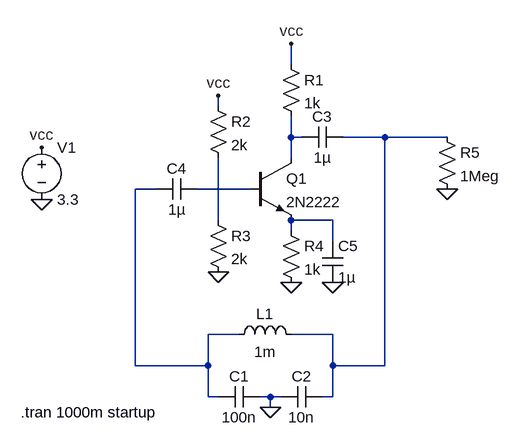
[diagram p0: schematic Colpitts_Oscillator.asc]
Colpitts_Oscillator.asc, the LTspice schematic file:
Version 4
SHEET 1 880 680
WIRE 416 -224 416 -256
WIRE 304 -160 304 -176
WIRE 416 -112 416 -144
WIRE 432 -112 416 -112
WIRE 560 -112 496 -112
WIRE 656 -112 560 -112
WIRE 416 -80 416 -112
WIRE 208 -32 176 -32
WIRE 352 -32 272 -32
WIRE 304 16 304 -80
WIRE 480 16 416 16
WIRE 416 32 416 16
WIRE 480 48 480 16
WIRE 336 192 288 192
WIRE 480 192 416 192
WIRE 176 240 176 -32
WIRE 288 240 288 192
WIRE 288 240 176 240
WIRE 480 240 480 192
WIRE 560 240 560 -112
WIRE 560 240 480 240
WIRE 288 288 288 240
WIRE 304 288 288 288
WIRE 384 288 368 288
WIRE 400 288 384 288
WIRE 480 288 480 240
WIRE 480 288 464 288
WIRE 384 304 384 288
FLAG 32 -96 vcc
FLAG 32 -16 0
FLAG 304 96 0
FLAG 416 112 0
FLAG 480 112 0
FLAG 384 304 0
FLAG 304 -176 vcc
FLAG 416 -256 vcc
FLAG 656 -32 0
SYMBOL voltage 32 -112 R0
WINDOW 123 0 0 Left 0
WINDOW 39 0 0 Left 0
SYMATTR InstName V1
SYMATTR Value 3.3
SYMBOL cap 304 304 R270
WINDOW 0 32 32 VTop 2
WINDOW 3 0 32 VBottom 2
SYMATTR InstName C1
SYMATTR Value 100n
SYMBOL cap 400 304 R270
WINDOW 0 32 32 VTop 2
WINDOW 3 0 32 VBottom 2
SYMATTR InstName C2
SYMATTR Value 10n
SYMBOL ind 320 208 R270
WINDOW 0 32 56 VTop 2
WINDOW 3 5 56 VBottom 2
SYMATTR InstName L1
SYMATTR Value 1m
SYMBOL cap 496 -128 R90
WINDOW 0 0 32 VBottom 2
WINDOW 3 32 32 VTop 2
SYMATTR InstName C3
SYMATTR Value 1µ
SYMBOL npn 352 -80 R0
SYMATTR InstName Q1
SYMATTR Value 2N2222
SYMBOL res 400 -240 R0
SYMATTR InstName R1
SYMATTR Value 1k
SYMBOL res 288 -176 R0
SYMATTR InstName R2
SYMATTR Value 2k
SYMBOL res 288 0 R0
SYMATTR InstName R3
SYMATTR Value 2k
SYMBOL cap 272 -48 R90
WINDOW 0 0 32 VBottom 2
WINDOW 3 32 32 VTop 2
SYMATTR InstName C4
SYMATTR Value 1µ
SYMBOL res 400 16 R0
SYMATTR InstName R4
SYMATTR Value 1k
SYMBOL cap 464 48 R0
SYMATTR InstName C5
SYMATTR Value 1µ
SYMBOL res 640 -128 R0
SYMATTR InstName R5
SYMATTR Value 1Meg
TEXT 0 312 Left 2 !.tran 1000m startup

The netlist it stands for:
* Colpitts_Oscillator.asc
V1 vcc 0 3.3
C1 N003 0 100n
C2 0 N002 10n
L1 N003 N002 1m
C3 N002 N001 1µ
Q1 N001 N004 N006 0 2N2222
R1 vcc N001 1k
R2 vcc N005 2k
R3 N005 0 2k
C4 N004 N003 1µ
R4 N006 0 1k
C5 N006 0 1µ
R5 N002 0 1Meg
.model NPN NPN
.model PNP PNP
.lib standard.bjt
.tran 1000m startup
.backanno
.end